# Altium project Vapeix_mini.PrjPcb
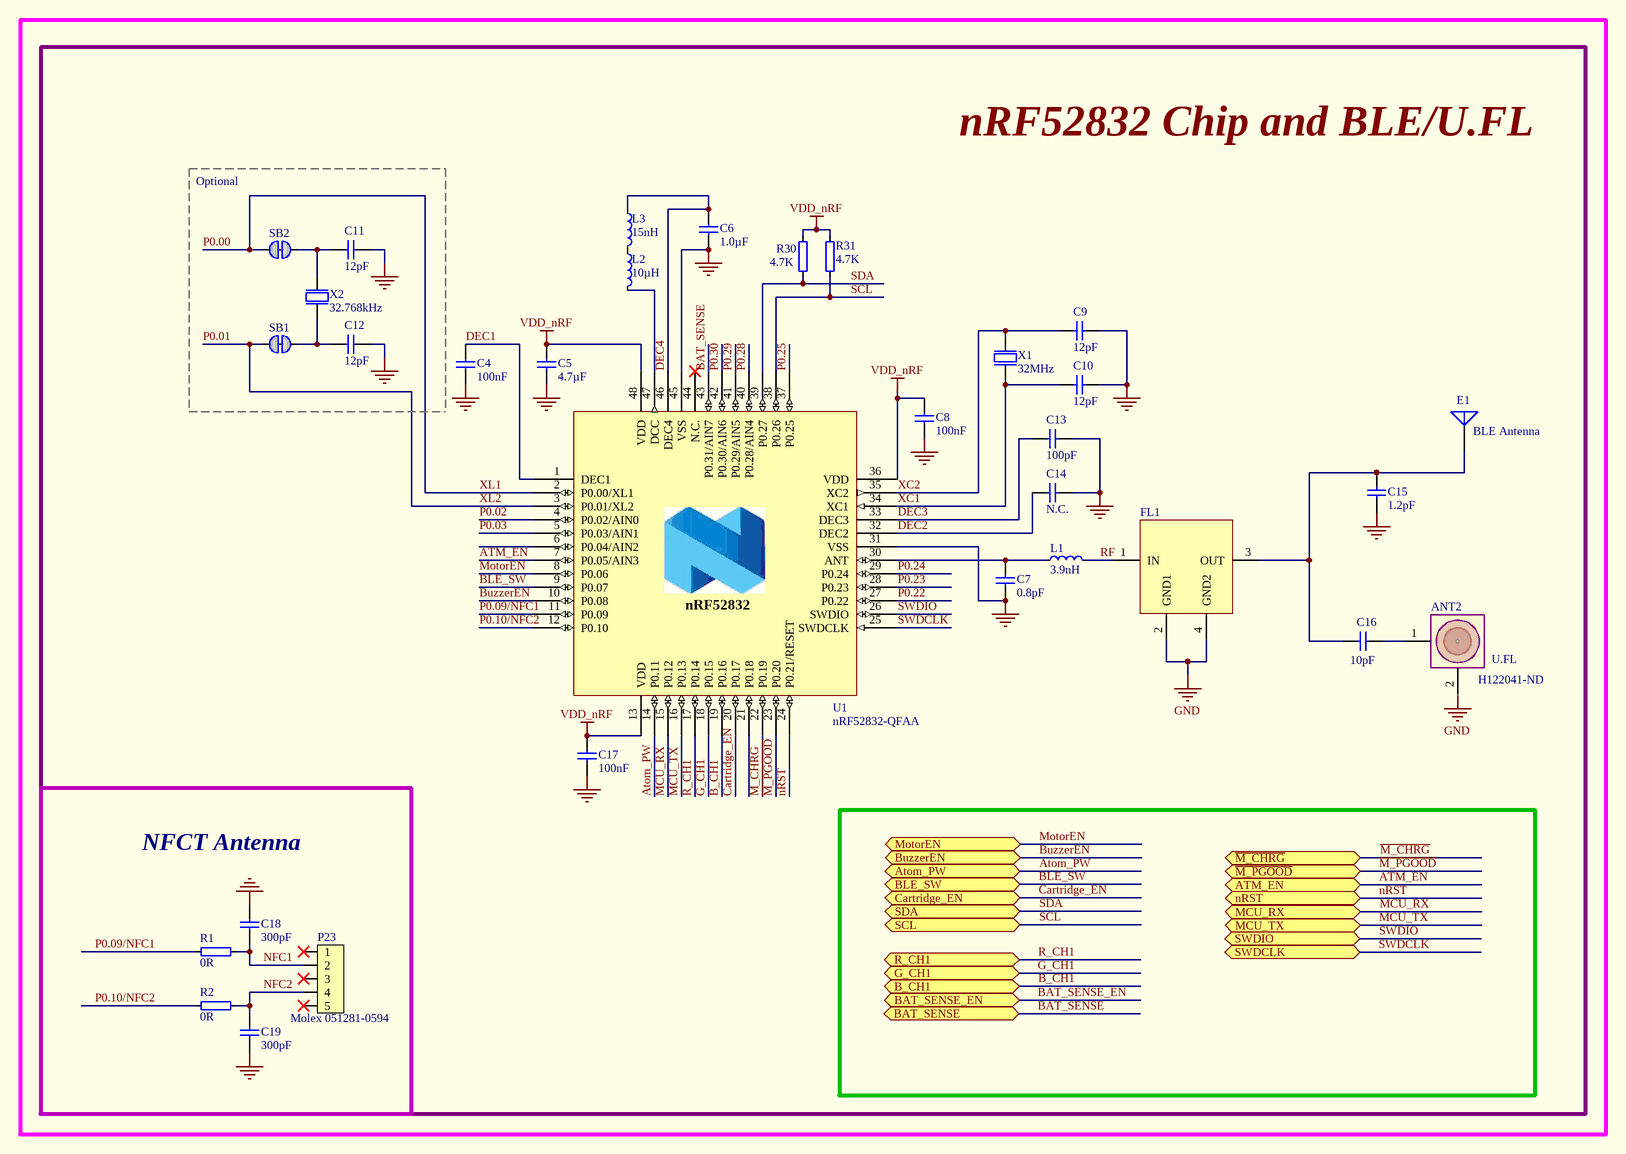
[diagram p0: Vapeix_mini_nrf.SchDoc]
4 sheets, 112 parts. Net scope: flat (ports and power ports of the same name join across sheets).
Sheets:
  Vapeix_mini_nrf.SchDoc
  Vapeix_mini_power.SchDoc
  Vapeix_mini_Shield.SchDoc
  Vapeix_mini_connector.SchDoc

## Sheet Vapeix_mini_nrf.SchDoc: Vapeix Mini PCB - nRF Radio
size A3; DrawnBy: Anne Moller; Organization: Altium Limited; Address1: L3, 12a Rodborough Rd; Address2: Frenchs Forest; Address3: NSW; Address4: Australia 2086; DocumentNumber: 1; Revision: v0.1; SheetNumber: 1; SheetTotal: 1

### Parts
(Parts that share a designator on the sheet are numbered #1, #2 ... from top to bottom, then left to right.)
ANT2  U.FL  Supplier Part Number 1: H122041-ND  [UFL-R-SMT]
C4  100nF  [CAPC1005X04L]
C5  4.7µF  [CAPC1608X06L]
C6  1.0µF  [CAPC1608X06L]
C7  0.8pF  [CAPC1005X04L]
C8  100nF  [CAPC1005X04L]
C9  12pF  [CAPC1005X04L]
C10  12pF  [CAPC1005X04L]
C11  12pF  [CAPC1005X04L]
C12  12pF  [CAPC1005X04L]
C13  100pF  [CAPC1005X04L]
C14  N.C.  [CAPC1005X04L]
C15  1.2pF  [CAPC1005X04L]
C16  10pF  [CAPC1005X04L]
C17  100nF  [CAPC1005X04L]
C18  300pF  [CAPC1005X04L]
C19  300pF  [CAPC1005X04L]
E1  BLE Antenna  [ANT_2450AT18A100]
FL1  DEA202450BT-1294C1-H  [DEA202450BT-1294C1-H]  (value not drawn)
L1  3.9nH  [INDC1005X04L]
L2  10µH  [INDC1608X06L]
L3  15nH  [INDC1005X04L]
P23  Molex 051281-0594  [Molex 051281-0594]
R1  0R  [RESC1005X04L]
R2  0R  [RESC1005X04L]
R30  4.7K  [RESC1005X04L]
R31#1  4.7K  [RESC1005X04L]
SB1  Solderbridge  [Solderbridge_Shorted]  (value not drawn)  (net tie, no BOM)
SB2  Solderbridge  [Solderbridge_Shorted]  (value not drawn)  (net tie, no BOM)
U1  nRF52832-QFAA  [QFN40P600X600X90-48N]
X1  32MHz  [BT-XTAL_2016]
X2  32.768kHz  [XTAL_3215]

### Blocks framed on the sheet
Optional: C11 C12 SB1 SB2 X2
NFCT Antenna: C18 C19 P23 R1 R2

### Ports
ATM_EN (bidir), Atom_PW (bidir), B_CH1 (bidir), BAT_SENSE (bidir), BAT_SENSE_EN (bidir), BLE_SW (bidir), BuzzerEN (bidir), Cartridge_EN (bidir), G_CH1 (bidir), MCU_RX (bidir), MCU_TX (bidir), MotorEN (bidir), nRST (bidir), R_CH1 (bidir), SCL (bidir), SDA (bidir), SWDCLK, SWDIO (bidir), ~{M_CHRG} (bidir), ~{M_PGOOD} (bidir)

### Nets
GND: C4.2 C5.2 C6.1 C7.1 C8.2 C9.2 C10.2 C11.1 C12.1 C13.2 C14.2 C15.2 C17.2 C18.2 C19.1 FL1.2(GND1) FL1.4(GND2) U1.31(VSS) U1.45(VSS) U1.49(GND) X1.2(GND) X1.4(GND)
VDD_nRF: C5.1 C8.1 C17.1 R30.2 R31#1.2 U1.13(VDD) U1.36(VDD) U1.48(VDD)
ATM_EN: U1.7(P0.05/AIN3) ; port ATM_EN
Atom_PW: U1.14(P0.11) ; port Atom_PW
B_CH1: U1.19(P0.16) ; port B_CH1
BAT_SENSE: U1.43(P0.31/AIN7) ; port BAT_SENSE
BLE_SW: U1.9(P0.07) ; port BLE_SW
BuzzerEN: U1.10(P0.08) ; port BuzzerEN
Cartridge_EN: U1.20(P0.17) ; port Cartridge_EN
DEC1: C4.1 U1.1(DEC1)
DEC2: C14.1 U1.32(DEC2)
DEC3: C13.1 U1.33(DEC3)
DEC4: C6.2 L3.1 U1.46(DEC4)
G_CH1: U1.18(P0.15) ; port G_CH1
~{M_PGOOD}: U1.23(P0.20) ; port ~{M_PGOOD}
M_CHRG: U1.22(P0.19)
MCU_RX: U1.15(P0.12) ; port MCU_RX
MCU_TX: U1.16(P0.13) ; port MCU_TX
MotorEN: U1.8(P0.06) ; port MotorEN
NFC1: C18.1 P23.2 R1.1
NFC2: C19.2 P23.4 R2.1
nRST: U1.24(P0.21/RESET) ; port nRST
P0.00: SB2.2 U1.2(P0.00/XL1)  [also labelled XL1]
P0.01: SB1.2 U1.3(P0.01/XL2)  [also labelled XL2]
P0.02: U1.4(P0.02/AIN0)
P0.03: U1.5(P0.03/AIN1)
P0.09/NFC1: R1.2 U1.11(P0.09)
P0.10/NFC2: R2.2 U1.12(P0.10)
P0.22: U1.27(P0.22)
P0.23: U1.28(P0.23)
P0.24: U1.29(P0.24)
P0.25: U1.37(P0.25)
P0.28: U1.40(P0.28/AIN4)
P0.29: U1.41(P0.29/AIN5)
P0.30: U1.42(P0.30/AIN6)
R_CH1: U1.17(P0.14) ; port R_CH1
RF: FL1.1(IN) L1.2
SCL: R31#1.1 U1.38(P0.26) ; port SCL
SDA: R30.1 U1.39(P0.27) ; port SDA
SWDCLK: U1.25(SWDCLK) ; port SWDCLK
SWDIO: U1.26(SWDIO) ; port SWDIO
XC1: C10.1 U1.34(XC1) X1.1(inp)
XC2: C9.1 U1.35(XC2) X1.3(out)
NetANT2_1: ANT2.1(SIG) C16.2
NetC7_2: C7.2 L1.1 U1.30(ANT)
NetC11_2: C11.2 SB2.1 X2.1(inp)
NetC12_2: C12.2 SB1.1 X2.2(out)
NetC15_1: C15.1 C16.1 E1.1(A) FL1.3(OUT)
NetL2_1: L2.1 L3.2
NetL2_2: L2.2 U1.47(DCC)

Not connected (* = marked no-connect by the designer): ANT2 2(GND); P23 1* 3* 5*; U1 6(P0.04/AIN2) 21(P0.18) 44(N.C.)*

### Notes on the sheet
- Labels drawn without touching a wire or pin: GND, nRF52832 Chip and BLE/U.FL
- Title
- Size:
- Date:
- A3
- Number:
- Time:
- Revision:
- Sheet
- of
- Drawn by:
- File:
- (in symbol nRF52832-QFAA) nRF52832

### Library data of the parts
ANT2 = U.FL-R-SMT-1(01): CONN UMC JACK STR 50 OHM SMD; Manufacturer: Hirose Electric Co Ltd; Connector Style: U.FL, Ultra Miniature Coaxial; Connector Type: Jack, Male Pin; Contact Termination: Solder; Impedance: 50 Ohm; Frequency - Max: 6GHz; Body Material: Phosphor Bronze; Body Finish: Silver; Center Contact Plating: Gold; Dielectric Material: Liquid Crystal Polymer (LCP); Supplier 1: Digi-Key; Manufacturer Part Number: U.FL-R-SMT-1(01); RoHS: RoHS Compliant; Category: Connectors, Interconnects; Stock 1: 2248; Pricing 1: 1=1.28, 10=1.122, 25=1.056, 50=1.012, 100=0.968, 250=0.88, 500=0.792, 1000=0.704, 2500=0.638 (USD); Packaging: Bulk; Shield Termination: Solder; Mounting Type: Surface Mount; Cable Group: -; Fastening Type: Snap-On; Features: -; Housing Color: Silver; Ingress Protection: -; Center Contact Material: Phosphor Bronze; Voltage Rating: -; Operating Temperature: -40°C ~ 90°C; ComponentLink1URL: http://media.digikey.com/pdf/Data%20Sheets/Hirose%20PDFs/UFL%20Series.pdf; ComponentLink1Description: http://media.digikey.com/pdf/Data%20Sheets/Hirose%20PDFs/UFL%20Series.pdf
C4 C8 C17 = C0402-100n: Capacitor, X7R, ±10%; Note: 16V; Artikkelnr Noca: 20039200; Artikkelnr Simpro: N.A.; Part Number: C0402-100n; Manufacturer: *; Manufacturer Part Number: *; Datasheet: *; LatestRevisionDate: 2009-11-23; Pin Count: 2; Publisher: Nordic Semiconductor; Published: 2009-05-08; Value: 100nF; Supplier: *; Supplier part number: *; 2nd source Supplier: *; 2nd source part number: *; Footprint Doc: 0402
C5 = C0603-4µ7: Capacitor, X5R, ±10%; Note: 6.3V; Artikkelnr Noca: 20069060; Artikkelnr Simpro: N.A.; Part Number: C0603-4µ7; Manufacturer: *; Manufacturer Part Number: *; Datasheet: *; LatestRevisionDate: 2009-11-23; Pin Count: 2; Publisher: Nordic Semiconductor; Published: 2009-05-08; Value: 4.7µF; Supplier: *; Supplier part number: *; 2nd source Supplier: *; 2nd source part number: *; Footprint Doc: 0603
C6 = C0603-1µ0: Capacitor, X7R, ±10%; Note: 16V; Artikkelnr Noca: 20039335; Artikkelnr Simpro: N.A.; Part Number: C0603-1µ0; Manufacturer: *; Manufacturer Part Number: *; Datasheet: *; LatestRevisionDate: 2013-06-05; Pin Count: 2; Publisher: Nordic Semiconductor; Published: 2009-05-08; Value: 1.0µF; Supplier: *; Supplier part number: *; 2nd source Supplier: *; 2nd source part number: *; Footprint Doc: 0603
C7 = C0402-0.8p: Capacitor, NP0, ±5%; Note: 50V; Artikkelnr Noca: 20029147; Artikkelnr Simpro: N.A.; Part Number: C0402-0.8p; Manufacturer: *; Manufacturer Part Number: *; Datasheet: *; LatestRevisionDate: 2012-11-21; Pin Count: 2; Publisher: Nordic Semiconductor; Published: 2009-05-08; Value: 0.8pF; Supplier: *; Supplier part number: *; 2nd source Supplier: *; 2nd source part number: *; Footprint Doc: 0402
C9-C12 = C0402-12p: Capacitor, NP0, ±2%; Note: 50V; Artikkelnr Noca: 20029159; Artikkelnr Simpro: N.A.; Part Number: C0402-12p; Manufacturer: *; Manufacturer Part Number: *; Datasheet: *; LatestRevisionDate: 2011-05-11; Pin Count: 2; Publisher: Nordic Semiconductor; Published: 2009-05-08; Value: 12pF; Supplier: *; Supplier part number: *; 2nd source Supplier: *; 2nd source part number: *; Footprint Doc: 0402
C13 = C0402-100p: Capacitor, NP0, ±5%; Note: 50V; Artikkelnr Noca: 20029135; Artikkelnr Simpro: N.A.; Part Number: C0402-100p; Manufacturer: *; Manufacturer Part Number: *; Datasheet: *; LatestRevisionDate: 2009-05-08; Pin Count: 2; Publisher: Nordic Semiconductor; Published: 2009-05-08; Value: 100pF; Supplier: *; Supplier part number: *; 2nd source Supplier: *; 2nd source part number: *; Footprint Doc: 0402
C14 C16 = C0402-N.C.: Not mounted; Note: Chip Cap; Artikkelnr Noca: N.A.; Part Number: C0402-N.C.; Manufacturer: *; Manufacturer Part Number: *; Datasheet: *; Footprint Doc: 0402; LatestRevisionDate: 2009-05-08; Pin Count: 2; Publisher: Nordic Semiconductor; Published: 2009-05-08; Supplier: *; Supplier part number: *; 2nd source Supplier: *; 2nd source part number: *; Artikkelnr Simpro: N.A.
  C14: Value: N.C.
  C16: Value: 10pF
C15 = C0402-1.2p: Capacitor, NP0, ±0.1pF; Note: 50V; Artikkelnr Noca: 20029157; Artikkelnr Simpro: N.A.; Part Number: C0402-1.2p; Manufacturer: *; Manufacturer Part Number: *; Datasheet: *; LatestRevisionDate: 2011-05-11; Pin Count: 2; Publisher: Nordic Semiconductor; Published: 2009-05-08; Value: 1.2pF; Supplier: *; Supplier part number: *; 2nd source Supplier: *; 2nd source part number: *; Footprint Doc: 0402
C18 C19 = C0402-300p: Capacitor, NP0, ±5%; Note: 50V; Artikkelnr Noca: N.A.; Part Number: C0402-300p; Manufacturer: *; Manufacturer Part Number: *; Datasheet: *; Footprint Doc: 0402; LatestRevisionDate: 2015-05-29; Pin Count: 2; Publisher: Nordic Semiconductor; Published: 2015-05-29; Value: 300pF; Supplier: Digi-Key; Supplier part number: 490-3234-1-ND; 2nd source Supplier: *; 2nd source part number: *; Artikkelnr Simpro: N.A.
E1 = Antenna: Generic Antenna; Published: 24-Mar-1999; LatestRevisionDate: 17-Jul-2002; LatestRevisionNote: Re-released for DXP Platform.; PackageReference: PIN1; Publisher: Altium Limited
FL1 = DEA202450BT-1294C1-H (2): FILTER BANDPASS WLAN&BLUETOOTH; Manufacturer: TDK Corporation; Supplier 1: Digi-Key; Manufacturer Part Number: DEA202450BT-1294C1-H; RoHS: RoHS Compliant; Category: Filters; Stock 1: 14479; Pricing 1: 1=0.51, 10=0.477, 100=0.4252, 250=0.40324, 500=0.33724, 1000=0.26173 (USD); ComponentLink1URL: https://product.tdk.com/info/en/documents/data_sheet/rf_bpf_dea202450bt-1294c1-h_en.pdf; ComponentLink1Description: https://product.tdk.com/info/en/documents/data_sheet/rf_bpf_dea202450bt-1294c1-h_en.pdf; Supplier Part Number 1: 445-172335-1-ND
L1 = L0402-3n9: Inductor, 170mA, ±0.1nH; Manufacturer: Murata; Manufacturer Part Number: LQP15MN3N9B02D; Note: High frequency chip inductor ±5%; Artikkelnr Noca: 33029151; Artikkelnr Simpro: N.A.; Part Number: L0402-3n9; Datasheet: http://search.murata.co.jp/Ceramy/image/img/PDF/ENG/L0075S0084LQP15M.pdf; LatestRevisionDate: 2012-09-19; Pin Count: 2; Publisher: Nordic Semiconductor; Published: 2009-05-08; Value: 3.9nH; Supplier: Digi-Key; Supplier part number: 490-1131-1-ND; 2nd source Supplier: *; 2nd source part number: *; Footprint Doc: 0402
L2 = L0603-10µ: Inductor, 80mA, ±10%; Manufacturer: Taiyo Yuden; Manufacturer Part Number: LBMF1608T100K; 2nd source part number: 178-6105; Note: LBMF1608T100K 10µH 80mA 0603; Artikkelnr Noca: 33029314; Artikkelnr Simpro: N.A.; Part Number: L0603-10µ; Datasheet: http://www.yuden.co.jp/ut/product/pdf/elb2_e.pdf; LatestRevisionDate: 2012-09-19; Pin Count: 2; Publisher: Nordic Semiconductor; Published: 2010-02-24; Value: 10µH; Supplier: Digi-Key; Supplier part number: 587-1714-1-ND; 2nd source Supplier: Farnell; Footprint Doc: 0603
L3 = L0402-15n: Inductor, 320mA, ±5%; Manufacturer: Taiyo Yuden; Manufacturer Part Number: HK100515NJ-T; 2nd source part number: 658-1328; Note: High frequency chip inductor ±10%; Artikkelnr Noca: 33029323; Artikkelnr Simpro: N.A.; Part Number: L0402-15n; LatestRevisionDate: 2012-09-19; Pin Count: 2; Publisher: Nordic Semiconductor; Published: 2010-07-12; Value: 15nH; Supplier: Digi-Key; Datasheet: http://www.yuden.co.jp/productdata/catalog/en/mlci04_e.pdf; Supplier part number: 587-1521-1-ND; 2nd source Supplier: Farnell; Footprint Doc: 0402
P23 = Molex 051281-0594: CONN FFC FPC 5POS 0.50MM R/A; Artikkelnr Noca: N.A.; Part Number: Molex 051281-0594; Manufacturer: Molex; Manufacturer Part Number: 051281-0594; Datasheet: http://www.molex.com/pdm_docs/sd/512810694_sd.pdf; Footprint Doc: Molex 051281-0594; LatestRevisionDate: 2015-06-22; Pin Count: 7; Publisher: Nordic Semiconductor; Published: 2015-06-22; Value: Molex 051281-0594; Note: *; Supplier: Digi-Key; Supplier part number: WM9836CT-ND; 2nd source Supplier: *; 2nd source part number: *; Artikkelnr Simpro: N.A.
R1 R2 = R0402-0R: Resistor, ±5%, 0.063W; Note: Chip Res 5%; Artikkelnr Noca: 27049000; Artikkelnr Simpro: N.A.; Part Number: R0402-0R; Manufacturer: *; Manufacturer Part Number: *; Datasheet: *; Footprint Doc: 0402; LatestRevisionDate: 2009-11-23; Pin Count: 2; Publisher: Nordic Semiconductor; Published: 2009-05-08; Value: 0R; Supplier: Farnell; Supplier part number: 146-9661; 2nd source Supplier: *; 2nd source part number: *
R30 R31#1 = R0402-10k: Resistor, ±1%, 0.063W; Note: Chip Res 1%; Artikkelnr Noca: 27049097; Artikkelnr Simpro: N.A.; Part Number: R0402-10k; Manufacturer: *; Manufacturer Part Number: *; Datasheet: *; Footprint Doc: 0402; LatestRevisionDate: 2009-11-23; Pin Count: 2; Publisher: Nordic Semiconductor; Published: 2009-05-08; Value: 4.7K; Supplier: Farnell; Supplier part number: 173-8864; 2nd source Supplier: *; 2nd source part number: *
SB1 SB2 = Solderbridge Shorted: Shorted Solderbridge; Artikkelnr Noca: N.A.; Part Number: Solderbridge Shorted; Manufacturer: *; Manufacturer Part Number: *; Datasheet: *; LatestRevisionDate: 2012-08-07; Pin Count: 2; Publisher: Nordic Semiconductor; Published: 2012-08-07; Value: Solderbridge; Note: *; Supplier: *; Supplier part number: *; 2nd source Supplier: *; 2nd source part number: *; Footprint Doc: Solderbridge_Shorted; Artikkelnr Simpro: N.A.
U1 = nRF52832-QFAA: Multi-protocol Bluetooth Low Energy and 2.4GHz proprietary system-on-chip; Manufacturer: Nordic Semiconductor; Artikkelnr Noca: N.A.; Part Number: nRF52832-QFAA; Manufacturer Part Number: nRF52832-QFAA; Datasheet: *; LatestRevisionDate: 2014-11-26; Pin Count: 48; Publisher: Nordic Semiconductor; Published: 2014-11-26; Value: nRF52832-QFAA; Note: *; Supplier: Nordic Semiconductor; Supplier part number: *; 2nd source Supplier: *; 2nd source part number: *; Footprint Doc: QFN-48; Artikkelnr Simpro: N.A.
X1 = XTAL_SMD2016_32MHz_8pF_Epson: XTAL SMD 2016, 32MHz, Cl=8pF, Tol: ±10ppm, Stab: ±10ppm; Manufacturer: Epson Toyocom; Manufacturer Part Number: Q22FA12800025; Note: XTAL SMD 32.000MHz; Artikkelnr Noca: N.A.; Part Number: XTAL_SMD2016_32MHz_8pF_Epson; Datasheet: http://www.epsondevice.com/docs/qd/en/DownloadServlet?id=ID000449; LatestRevisionDate: 2014-11-27; Pin Count: 4; Publisher: Nordic Semiconductor; Published: 2012-03-09; Value: 32MHz; Supplier: Farnell; Supplier part number: 171-2806; 2nd source Supplier: *; 2nd source part number: *; Footprint Doc: XTAL_2016; Artikkelnr Simpro: N.A.
X2 = XTAL_FC-135 32.768k: EPSON TOYOCOM - FC-135 32.768KHZ ±20PPM,9.0PF - CRYSTAL, SM, WATCH; 2nd source part number: 127-8037; Note: XTAL SMD 32.768kHz, 3215; Artikkelnr Noca: 22019091; Artikkelnr Simpro: N.A.; Part Number: XTAL_FC-135 32.768k; Manufacturer: Epson Toyocom; Manufacturer Part Number: FC-135 32.768KHZ ±20PPM,9.0PF; Datasheet: http://www.farnell.com/datasheets/57480.pdf; LatestRevisionDate: 2014-03-27; Pin Count: 2; Publisher: Nordic Semiconductor; Published: 2010-10-18; Value: 32.768kHz; Supplier: Digi-Key; Supplier part number: FC-135 32.7680KA-AC-ND; 2nd source Supplier: Farnell; Footprint Doc: XTAL_3215

## Sheet Vapeix_mini_power.SchDoc: Vapeix Mini PCB - Power Supply
size A3; DrawnBy: Anne Moller; Organization: Altium Limited; Address1: L3, 12a Rodborough Rd; Address2: Frenchs Forest; Address3: NSW; Address4: Australia 2086
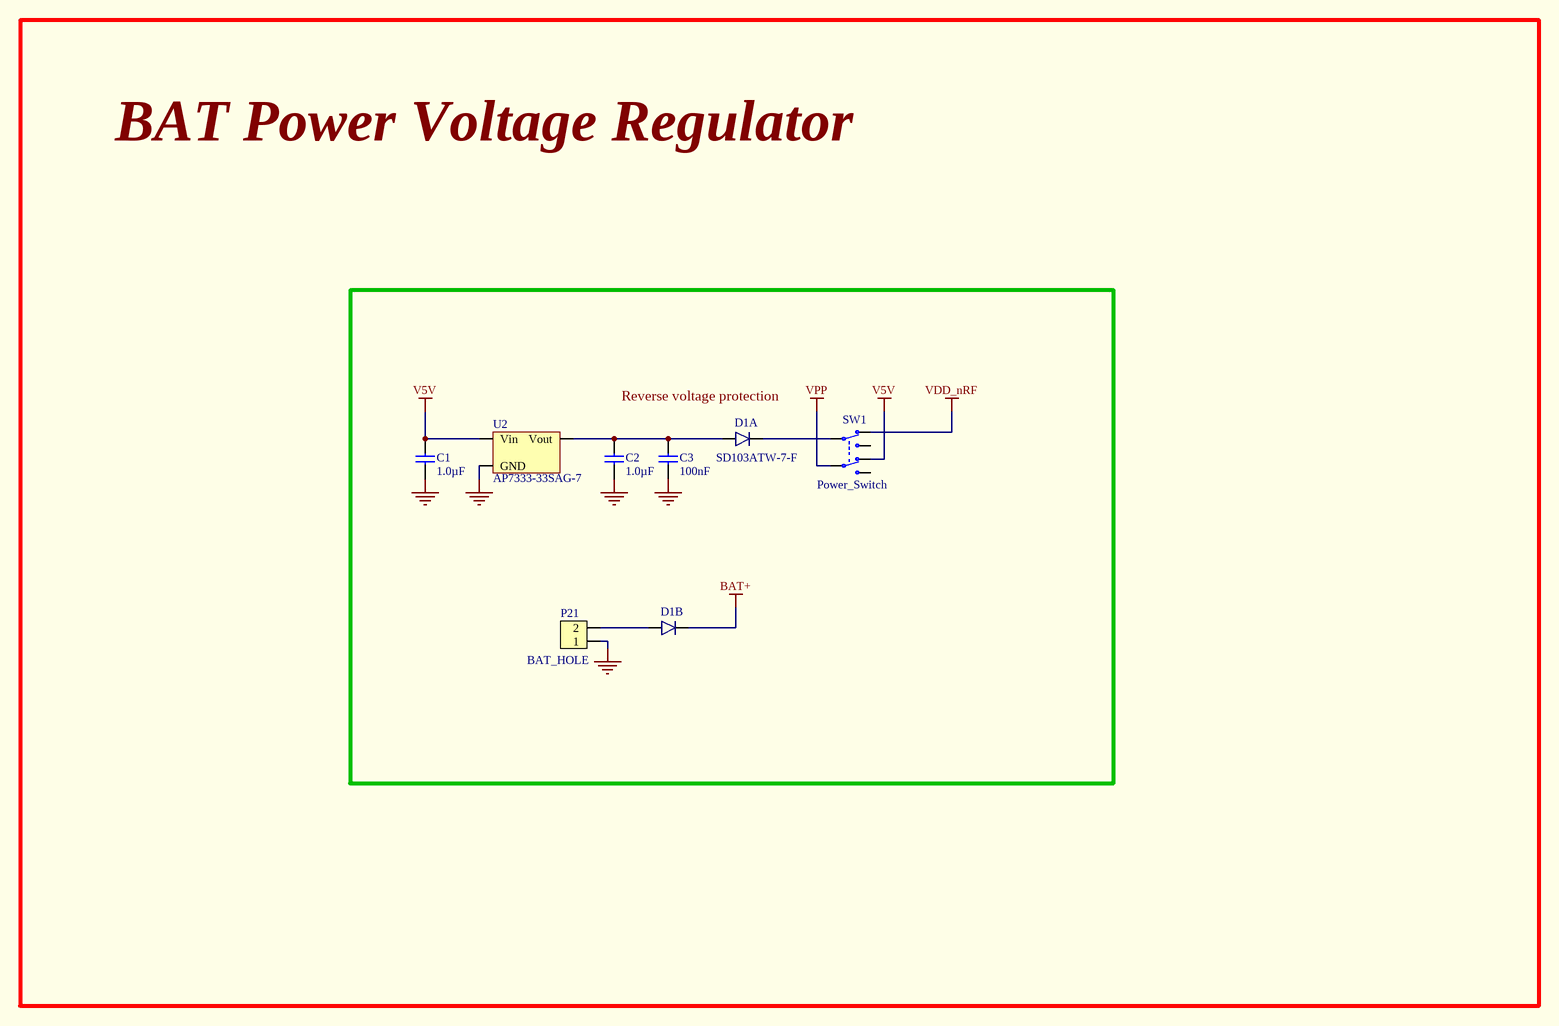
[diagram p1: Vapeix_mini_power.SchDoc]

### Parts
C1  1.0µF  [CAPC1608X06L]
C2  1.0µF  [CAPC1608X06L]
C3  100nF  [CAPC1005X04L]
D1  SD103ATW-7-F  [SOT-363]  (parts A,B of 3)
P21  BAT_HOLE  [LIST_ANG_1x2-SMD-2.54MM]
SW1  Power_Switch  [JS202011SCQN]
U2  AP7333-33SAG-7  [SOT-23A]

### Blocks framed on the sheet
Reverse voltage protection: C1-C3 D1 P21 SW1 U2

### Nets
BAT+: D1.2(C2)
GND: C1.1 C2.1 C3.1 P21.1 U2.3(GND)
V5V: C1.2 SW1.6(N.C-2) U2.1(Vin)
VDD_nRF: SW1.3(N.C-1)
VPP: SW1.5(COM-2)
NetC2_2: C2.2 C3.2 D1.6(A1) U2.2(Vout)
NetD1_1: D1.1(C1) SW1.2(COM-1)
NetD1_5: D1.5(A2) P21.2

Not connected (* = marked no-connect by the designer): SW1 1(N.O-1) 4(N.O-2)

### Notes on the sheet
- Labels drawn without touching a wire or pin: BAT Power Voltage Regulator
- Title
- Size:
- Date:
- A3
- Number:
- Time:
- Revision:
- Sheet
- of
- Drawn by:
- File:

### Library data of the parts
C1 C2 = C0603-1µ0: as C6 on sheet Vapeix_mini_nrf; Published: 2009-05-08; LatestRevisionDate: 2013-06-05; Publisher: Nordic Semiconductor; Value: 1.0µF; Part Number: C0603-1µ0; Manufacturer: *; Manufacturer Part Number: *; Datasheet: *; Pin Count: 2; Supplier: *; Supplier part number: *; 2nd source Supplier: *; 2nd source part number: *; Footprint Doc: 0603
C3 = C0402-100n: as C4 on sheet Vapeix_mini_nrf; Published: 2009-05-08; LatestRevisionDate: 2009-11-23; Publisher: Nordic Semiconductor; Value: 100nF; Part Number: C0402-100n; Manufacturer: *; Manufacturer Part Number: *; Datasheet: *; Pin Count: 2; Supplier: *; Supplier part number: *; 2nd source Supplier: *; 2nd source part number: *; Footprint Doc: 0402
D1 = D:DIODE_3_IND: Surface Mount Schottky Barrier Diode Array; Manufacturer: Diodes Incorporated; 2nd source part number: 177-3507; Artikkelnr Noca: 10029109; Artikkelnr Simpro: N.A.; Part Number: SD103ATW-7-F; Manufacturer Part Number: SD103ATW-7-F; Datasheet: http://www.diodes.com/datasheets/ds30374.pdf; LatestRevisionDate: 2012-06-15; Publisher: Nordic Semiconductor; Published: 2012-06-15; Value: SD103ATW-7-F; Note: *; Supplier: Digi-Key; Supplier part number: SD103ATW-FDITR-ND; 2nd source Supplier: Farnell; Footprint Doc: SOT-363
P21 = Pin List Ang 1x2 SMD, 2.54mm: Pin List 1x2, 2.54mm (100mil), Right Angled, SMD; 2nd source part number: S1113E-02-ND; Artikkelnr Noca: N.A.; Part Number: Pin List Ang 1x2 SMD, 2.54mm; Manufacturer: *; Manufacturer Part Number: *; Datasheet: *; LatestRevisionDate: 2014-04-30; Pin Count: 2; Publisher: Nordic Semiconductor; Published: 2014-04-30; Value: BAT_HOLE; Note: *; Supplier: Samtec; Supplier part number: TSM-102-01-L-SH-A; 2nd source Supplier: Digi-Key; Footprint Doc: LIST_ANG_1x2-SMD-2.54MM; Artikkelnr Simpro: N.A.
SW1 = JS202011SCQN: SMD slide Switch (ON-ON); Manufacturer: C&K Components; 2nd source part number: 232-0019; Artikkelnr Noca: N.A.; Part Number: JS202011SCQN; Manufacturer Part Number: JS202011SCQN; Datasheet: http://www.ck-components.com/14398/js_14july11.pdf/; LatestRevisionDate: 2014-06-24; Pin Count: 6; Publisher: Nordic Semiconductor; Published: 2014-06-24; Value: Power_Switch; Note: *; Supplier: Digi-Key; Supplier part number: 401-2002-1-ND; 2nd source Supplier: Farnell; Footprint Doc: JS202011SCQN; Artikkelnr Simpro: N.A.
U2 = AP7333-33SAG-7: 300mA, Low Quiescent Current, Fast Transient Low Dropout Linear Regulator; Manufacturer: Diodes Incorporated; Artikkelnr Noca: 17039216; Artikkelnr Simpro: N.A.; Part Number: AP7333-33SAG-7; Manufacturer Part Number: AP7333-33SAG-7; Datasheet: http://www.diodes.com/datasheets/AP7333.pdf; LatestRevisionDate: 2012-06-15; Pin Count: 3; Publisher: Nordic Semiconductor; Published: 2012-06-15; Value: AP7333-33SAG-7; Note: *; Supplier: Digi-Key; Supplier part number: AP7333-33SAG-7DICT-ND; 2nd source Supplier: *; 2nd source part number: *; Footprint Doc: SOT-23-3

## Sheet Vapeix_mini_Shield.SchDoc: Vapeix Mini PCB - Interface
size A3; DrawnBy: Anne Moller; Organization: Altium Limited; Address1: L3, 12a Rodborough Rd; Address2: Frenchs Forest; Address3: NSW; Address4: Australia 2086
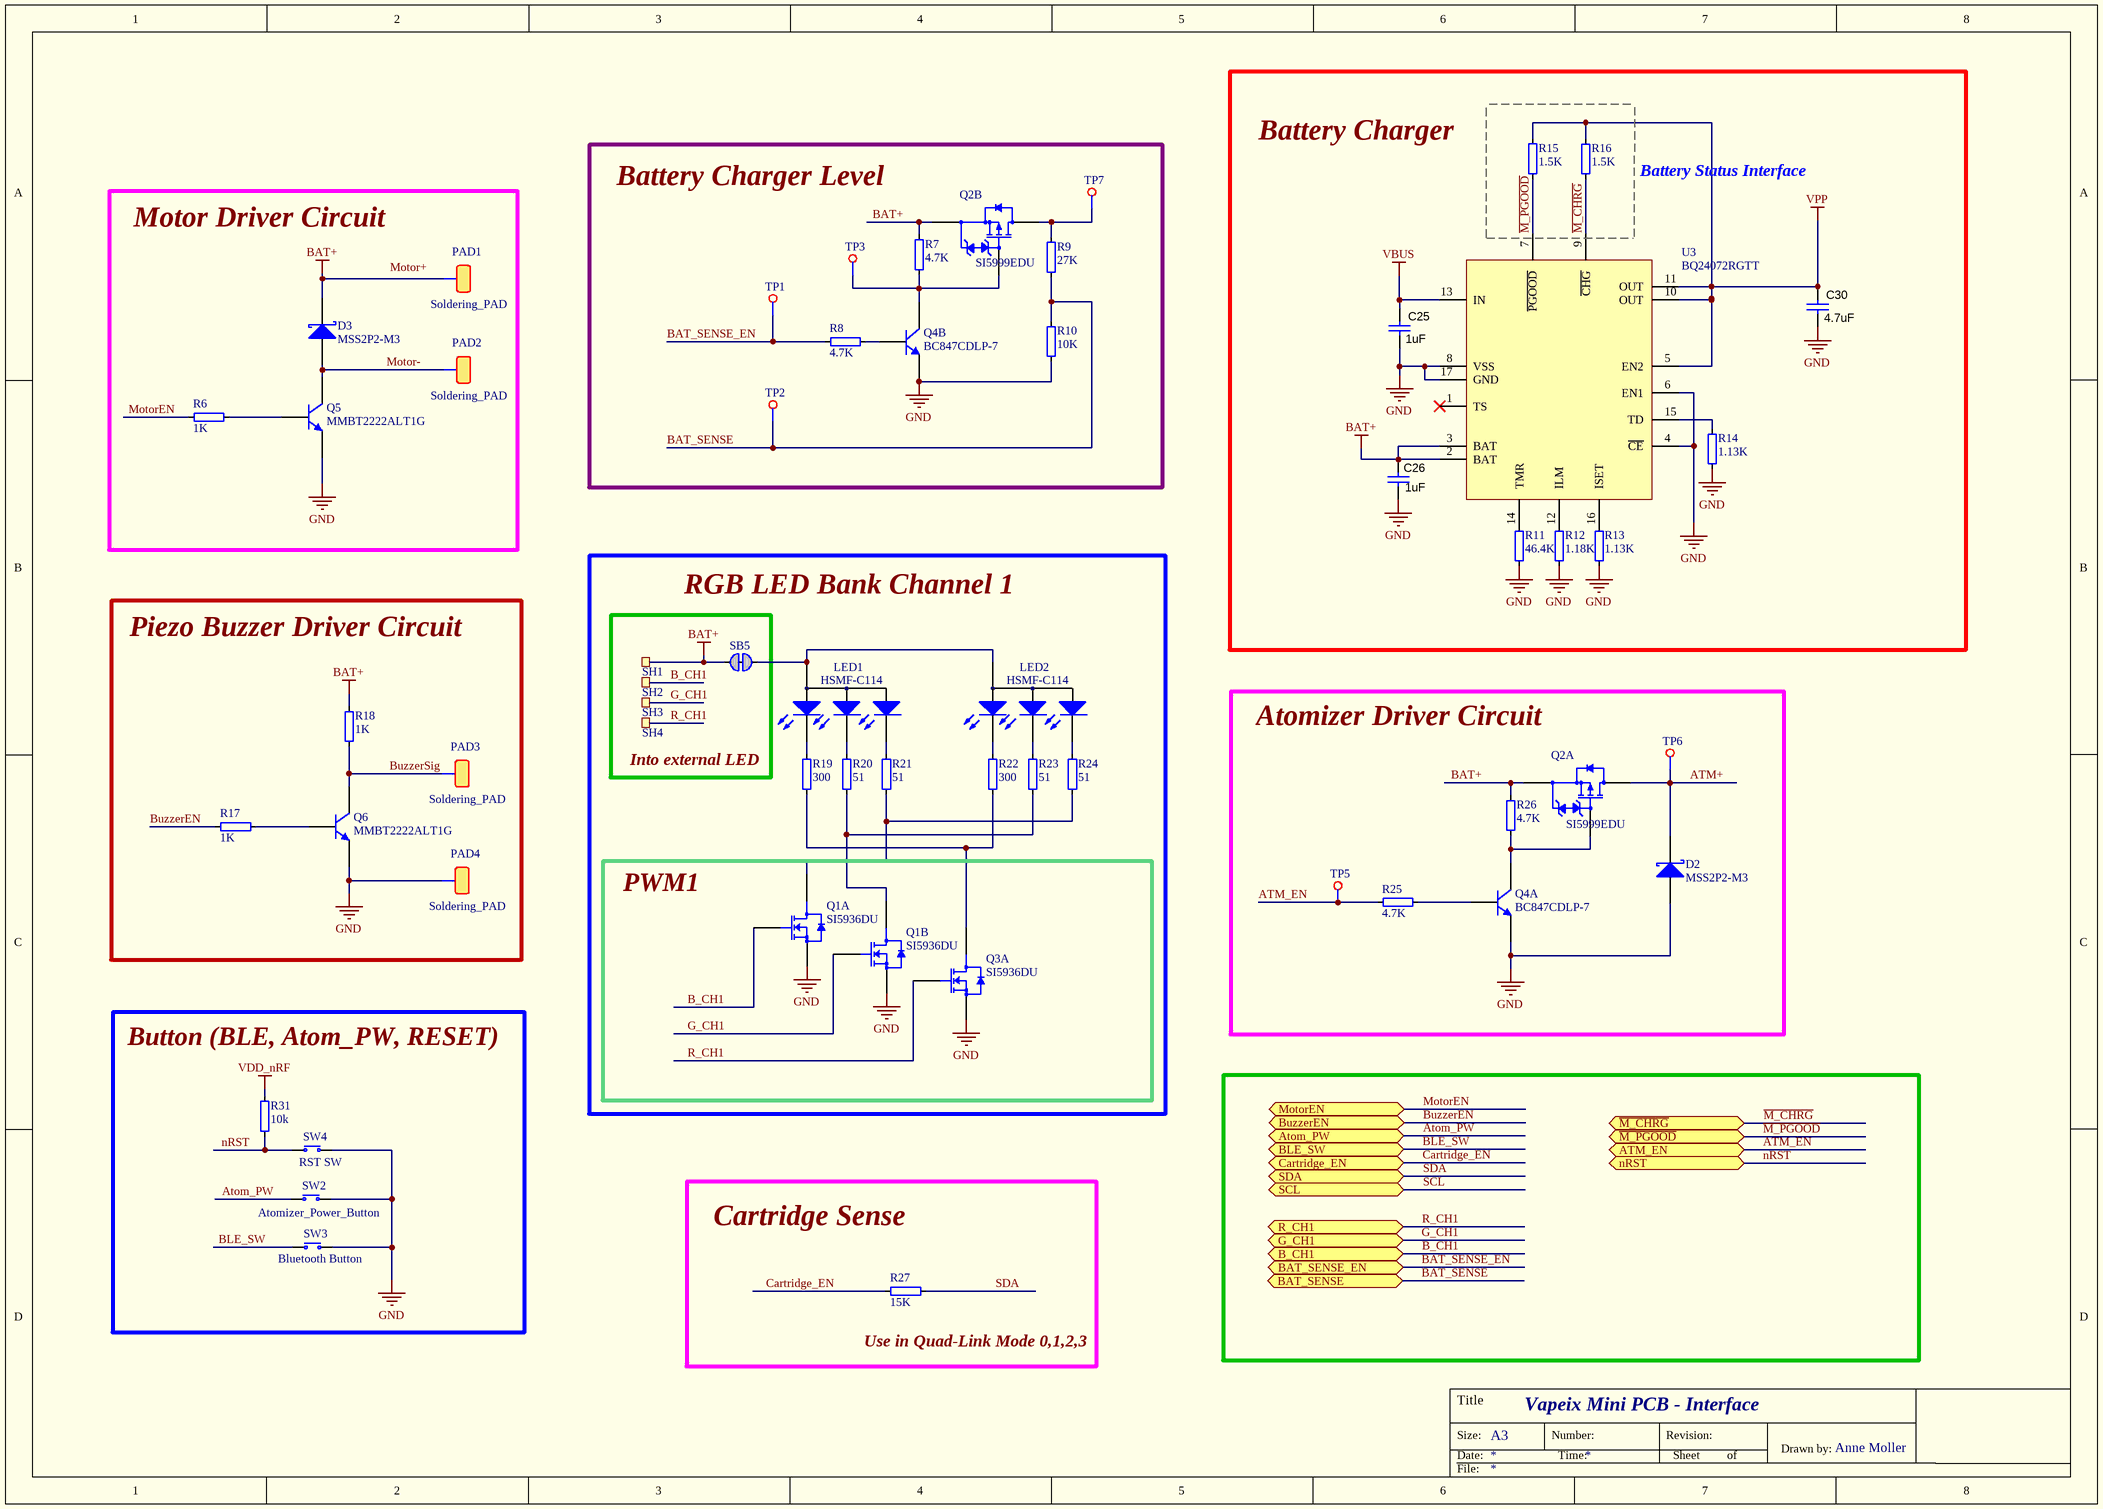
[diagram p2: Vapeix_mini_Shield.SchDoc]

### Parts
(Parts that share a designator on the sheet are numbered #1, #2 ... from top to bottom, then left to right.)
C25  ValueDisplayed: 1uF  [CAPC1608X06L]
C26  ValueDisplayed: 1uF  [CAPC1608X06L]
C30  ValueDisplayed: 4.7uF  [CAPC1608X06L]
D2  MSS2P2-M3  [MSS2P2-M3]
D3  MSS2P2-M3  [MSS2P2-M3]
LED1  HSMF-C114  [HSMF-C114]
LED2  HSMF-C114  [HSMF-C114]
PAD1  Soldering_PAD  [Soldering_PAD]
PAD2  Soldering_PAD  [Soldering_PAD]
PAD3  Soldering_PAD  [Soldering_PAD]
PAD4  Soldering_PAD  [Soldering_PAD]
Q1  SI5936DU  [SI5936DU]  (parts A,B of 2)
Q2  SI5999EDU  [SI5999EDU]  (parts A,B of 2)
Q3  SI5936DU  [SI5936DU]  (part A of 2)
Q4  BC847CDLP-7  [BC847CDLP-7]  (parts A,B of 2)
Q5  MMBT2222ALT1G  [MMBT2222ALT1G]
Q6  MMBT2222ALT1G  [MMBT2222ALT1G]
R6  1K  [RESC1005X04L]
R7  4.7K  [RESC1005X04L]
R8  4.7K  [RESC1005X04L]
R9  27K  [RESC1005X04L]
R10  10K  [RESC1005X04L]
R11  46.4K  [RESC1005X04L]
R12  1.18K  [RESC1005X04L]
R13  1.13K  [RESC1005X04L]
R14  1.13K  [RESC1005X04L]
R15  1.5K  [RESC1005X04L]
R16  1.5K  [RESC1005X04L]
R17  1K  [RESC1005X04L]
R18  1K  [RESC1005X04L]
R19  300  [RESC1005X04L]
R20  51  [RESC1005X04L]
R21  51  [RESC1005X04L]
R22  300  [RESC1005X04L]
R23  51  [RESC1005X04L]
R24  51  [RESC1005X04L]
R25  4.7K  [RESC1005X04L]
R26  4.7K  [RESC1005X04L]
R27  15K  [RESC1005X04L]
R31#2  10k  [RESC1005X04L]
SB5  Solderbridge  [Solderbridge_Shorted]  (value not drawn)  (net tie, no BOM)
SH1  TP  [TESTPAD-TH]  (value not drawn)  (no BOM)
SH2  TP  [TESTPAD-TH]  (value not drawn)  (no BOM)
SH3  TP  [TESTPAD-TH]  (value not drawn)  (no BOM)
SH4  TP  [TESTPAD-TH]  (value not drawn)  (no BOM)
SW2  Atomizer_Power_Button  [ALPS_SKHUxxx010_WO_GND]
SW3  Bluetooth Button  [ALPS_SKHUxxx010_WO_GND]
SW4  RST SW  [ALPS_SKHUxxx010_WO_GND]
TP1#1  TP  [TP]  (value not drawn)
TP2#1  TP  [TP]  (value not drawn)
TP3#1  TP  [TP]  (value not drawn)
TP5  TP  [TP]  (value not drawn)
TP6  TP  [TP]  (value not drawn)
TP7  TP  [TP]  (value not drawn)
U3  BQ24072RGTT  [BQ24072RGTT]

### Ports
ATM_EN (bidir), Atom_PW (bidir), B_CH1 (bidir), BAT_SENSE, BAT_SENSE_EN (bidir), BLE_SW (bidir), BuzzerEN (bidir), Cartridge_EN (bidir), G_CH1 (bidir), MotorEN (bidir), nRST (bidir), R_CH1 (bidir), SCL (bidir), SDA (bidir), ~{M_CHRG} (bidir), ~{M_PGOOD} (bidir)

### Nets
BAT+: C26.1 D3.2(K) PAD1.1(TP) Q2.1(S1) Q2.3(S2) R7.1 R18.1 R26.2 SB5.2 SH1.1 U3.2(BAT) U3.3(BAT)
GND: C25.2 C26.2 C30.2 D2.1(A) PAD4.1(TP) Q1.1(S1) Q1.3(S2) Q3.1(S1) Q4.1(E1) Q4.4(E2) Q5.2(E) Q6.2(E) R10.2 R11.2 R12.2 R13.2 R14.2 SW2.2(COM) SW3.2(COM) SW4.2(COM) U3.4(~{CE}) U3.6(EN1) U3.8(VSS) U3.17(GND)
VBUS: C25.1 U3.13(IN)
VDD_nRF: R31#2.2
VPP: C30.1 R15.1 R16.1 U3.5(EN2) U3.10(OUT) U3.11(OUT)
ATM+: D2.2(K) Q2.7(D1) TP6.1(TP)
ATM_EN: R25.1 TP5.1(TP) ; port ATM_EN
Atom_PW: SW2.1(N.O) ; port Atom_PW
B_CH1: Q1.2(G1) SH2.1 ; port B_CH1
BAT_SENSE: R9.2 R10.1 TP2#1.1(TP) ; port BAT_SENSE
BAT_SENSE_EN: R8.2 TP1#1.1(TP) ; port BAT_SENSE_EN
BLE_SW: SW3.1(N.O) ; port BLE_SW
BuzzerEN: R17.2 ; port BuzzerEN
BuzzerSig: PAD3.1(TP) Q6.3(C) R18.2
Cartridge_EN: R27.2 ; port Cartridge_EN
G_CH1: Q1.4(G2) SH3.1 ; port G_CH1
~{M_CHRG}: R16.2 U3.9(~{CHG}) ; port ~{M_CHRG}
~{M_PGOOD}: R15.2 U3.7(~{PGOOD}) ; port ~{M_PGOOD}
Motor-: D3.1(A) PAD2.1(TP) Q5.3(C)
MotorEN: R6.2 ; port MotorEN
nRST: R31#2.1 SW4.1(N.O) ; port nRST
R_CH1: Q3.2(G1) SH4.1 ; port R_CH1
SDA: R27.1 ; port SDA
NetLED1_1: LED1.1(ANODE) LED2.1(ANODE) SB5.1
NetLED1_2: LED1.2(RED) R19.1
NetLED1_3: LED1.3(GREEN) R20.1
NetLED1_4: LED1.4(BLUE) R21.1
NetLED2_2: LED2.2(RED) R22.1
NetLED2_3: LED2.3(GREEN) R23.1
NetLED2_4: LED2.4(BLUE) R24.1
NetQ1_5: Q1.5(D2) R20.2 R23.2
NetQ1_7: Q1.7(D1) R21.2 R24.2
NetQ2_2: Q2.2(G1) Q4.3(C1) R26.1
NetQ2_4: Q2.4(G2) Q4.6(C2) R7.2 TP3#1.1(TP)
NetQ2_5: Q2.5(D2) R9.1 TP7.1(TP)
NetQ3_7: Q3.7(D1) R19.2 R22.2
NetQ4_2: Q4.2(B1) R25.2
NetQ4_5: Q4.5(B2) R8.1
NetQ5_1: Q5.1(B) R6.1
NetQ6_1: Q6.1(B) R17.1
NetR11_1: R11.1 U3.14(TMR)
NetR12_1: R12.1 U3.12(ILM)
NetR13_1: R13.1 U3.16(ISET)
NetR14_1: R14.1 U3.15(TD)

Not connected (* = marked no-connect by the designer): U3 1(TS)*

### Notes on the sheet
- Labels drawn without touching a wire or pin: Atomizer Driver Circuit, Battery Charger, Battery Charger Level, Battery Status Interface, Button (BLE, Atom_PW, RESET), Cartridge Sense, Into external LED, Motor Driver Circuit, Motor+, Piezo Buzzer Driver Circuit, PWM1, RGB LED Bank Channel 1, Use in Quad-Link Mode 0,1,2,3
- Title
- Size:
- Date:
- A3
- Number:
- Time:
- Revision:
- Sheet
- of
- Drawn by:
- File:

### Library data of the parts
C25 C26 C30 = GRM219R61A106KE44D: CAP, CERM, 10 µF, 10 V, +/- 10%, X5R, 0805; Manufacturer: MuRata; Polarized: N; CompType: Capacitor; Value: 10uF; U/M: EA; Cap_F: 0.00001; Tolerance_%: 10; ESR_ohm: 0.005; Value1: 0.005 ohm; Value2: 10V; TaMin_C: -55; TaMax_C: 85; Cap_Case: 0805; SymbolVersion: 2008-07-09; PartNumber: GRM219R61A106KE44D; PackageReference: 0805; RoHS: Y; VDC_V: 10; MountType: SMT; Technology: Ceramic; TempCo: X5R; Published: 2008-06-19; Publisher: Texas Instruments; LatestRevisionDate: 2014-08-19; ComponentLink1Description: Datasheet link; ComponentLink1URL: http://psearch.murata.com/capacitor/product/GRM219R61A106KE44%23.pdf; Supplier 1: Digi-Key; Supplier Part Number 1: 490-4735-1-ND; Supplier 2: Mouser; Supplier Part Number 2: 81-GRM219R61A106KE4D; Supplier 3: Farnell; Supplier Part Number 3: 1845741
D2 D3 = MSS2P2-M3/89A: DIODE SCHOTTKY 20V 2A MICROSMP; Manufacturer: Vishay Semiconductor Diodes Division; Voltage - Forward (Vf) (Max) @ If: 600mV @ 2A; Speed: Fast Recovery =< 500ns, > 200mA (Io); Current - Reverse Leakage @ Vr: 250µA @ 20V; Capacitance @ Vr, F: 65pF @ 4V, 1MHz; Supplier 1: Digi-Key; Manufacturer Part Number: MSS2P2-M3/89A; RoHS: RoHS Compliant; Category: Discrete Semiconductor Products; Stock 1: 3961; Pricing 1: 1=0.37, 10=0.274, 100=0.1552, 500=0.1029, 1000=0.07892 (USD); Packaging: Digi-Reel®; Diode Type: Schottky; Voltage - DC Reverse (Vr) (Max): 20V; Current - Average Rectified (Io): 2A; Reverse Recovery Time (trr): -; Mounting Type: Surface Mount; Package / Case: MicroSMP; Supplier Device Package: MicroSMP; Operating Temperature - Junction: -55°C ~ 150°C; ComponentLink1URL: http://www.vishay.com/docs/89054/mss2p3.pdf; ComponentLink1Description: http://www.vishay.com/docs/89054/mss2p3.pdf
LED1 LED2 = HSMF-C114: LED RGB DIFFUSED 0606 SMD; Manufacturer: Broadcom Limited; Color: Red, Green, Blue (RGB); Lens Color: White; Millicandela Rating: 85mcd Red, 180mcd Green, 70mcd Blue; Lens Style/Size: Rectangle with Flat Top, 1.10mm x 1.50mm; Voltage - Forward (Vf) (Typ): 1.9V Red, 3.4V Green, 3.4V Blue; Current - Test: 20mA Red, 20mA Green, 20mA Blue; Viewing Angle: 140° Red, 145° Green, 145° Blue; Wavelength - Dominant: 626nm Red, 525nm Green, 470nm Blue; Wavelength - Peak: 637nm Red, 523nm Green, 468nm Blue; Supplier 1: Digi-Key; Manufacturer Part Number: HSMF-C114; RoHS: RoHS Compliant; Category: Optoelectronics; Stock 1: 11787; Pricing 1: 1=2.03, 10=1.62, 25=1.2376, 100=1.125, 250=0.99, 500=0.8325, 1000=0.72 (USD); Packaging: Digi-Reel®; Lens Transparency: Diffused; Mounting Type: Surface Mount; Features: -; Package / Case: 0606 (1616 Metric); Supplier Device Package: Chip LED; Size / Dimension: 1.60mm L x 1.50mm W; Height (Max): 0.35mm; ComponentLink1URL: http://www.avagotech.com/docs/AV02-2451EN; ComponentLink1Description: http://www.avagotech.com/docs/AV02-2451EN
PAD1-PAD4 = Soldering_PAD: Soldering PAD
Q1 Q3 = SI5936DU-T1-GE3: MOSFET 2N-CH 30V 6A PWRPK CHPFET; Manufacturer: Vishay Siliconix; FET Type: 2 N-Channel (Dual); FET Feature: Logic Level Gate; Rds On (Max) @ Id, Vgs: 30 mOhm @ 5A, 10V; Vgs(th) (Max) @ Id: 2.2V @ 250µA; Gate Charge (Qg) @ Vgs: 11nC @ 10V; Input Capacitance (Ciss) @ Vds: 320pF @ 15V; Power - Max: 10.4W; Supplier 1: Digi-Key; Manufacturer Part Number: SI5936DU-T1-GE3; RoHS: RoHS Compliant; Category: Discrete Semiconductor Products; Stock 1: 0; Pricing 1: 1=0.66, 10=0.578, 100=0.442, 500=0.3502, 1000=0.2805 (USD); Packaging: Cut Tape (CT); Drain to Source Voltage (Vdss): 30V; Current - Continuous Drain (Id) @ 25°C: 6A; Operating Temperature: -55°C ~ 150°C (TJ); Mounting Type: Surface Mount; Package / Case: PowerPAK® ChipFET™ Dual; Supplier Device Package: PowerPAK® ChipFet Dual; ComponentLink1URL: http://www.vishay.com/docs/62804/si5936du.pdf; ComponentLink1Description: http://www.vishay.com/docs/62804/si5936du.pdf; Supplier Part Number 1: SI5936DU-T1-GE3CT-ND
Q2 = SI5999EDU-T1-GE3: MOSFET 2P-CH 20V 6A POWERPAK; Manufacturer: Vishay Siliconix; FET Type: 2 P-Channel (Dual); FET Feature: Logic Level Gate; Rds On (Max) @ Id, Vgs: 59 mOhm @ 3.5A, 4.5V; Vgs(th) (Max) @ Id: 1.5V @ 250µA; Gate Charge (Qg) @ Vgs: 20nC @ 10V; Input Capacitance (Ciss) @ Vds: 496pF @ 10V; Power - Max: 10.4W; Supplier 1: Digi-Key; Manufacturer Part Number: SI5999EDU-T1-GE3; RoHS: RoHS Compliant; Category: Discrete Semiconductor Products; Stock 1: 2994; Pricing 1: 1=0.58, 10=0.51, 100=0.39, 500=0.309, 1000=0.2475 (USD); Packaging: Cut Tape (CT); Drain to Source Voltage (Vdss): 20V; Current - Continuous Drain (Id) @ 25°C: 6A; Operating Temperature: -55°C ~ 150°C (TJ); Mounting Type: Surface Mount; Package / Case: PowerPAK® ChipFET™ Dual; Supplier Device Package: PowerPAK® ChipFet Dual; ComponentLink1URL: http://www.vishay.com/docs/67019/si5999ed.pdf; ComponentLink1Description: http://www.vishay.com/docs/67019/si5999ed.pdf
Q4 = BC847CDLP-7: TRANS 2NPN 45V 0.1A 6DFN; Manufacturer: Diodes Incorporated; Transistor Type: 2 NPN (Dual); Current - Collector (Ic) (Max): 100mA; Vce Saturation (Max) @ Ib, Ic: 600mV @ 5mA, 100mA; Current - Collector Cutoff (Max): 15nA; DC Current Gain (hFE) (Min) @ Ic, Vce: 420 @ 2mA, 5V; Power - Max: 350mW; Frequency - Transition: 100MHz; Supplier 1: Digi-Key; Manufacturer Part Number: BC847CDLP-7; RoHS: RoHS Compliant; Category: Discrete Semiconductor Products; Stock 1: 11845; Pricing 1: 1=0.36, 10=0.29, 100=0.198, 500=0.1482, 1000=0.111 (USD); Packaging: Cut Tape (CT); Voltage - Collector Emitter Breakdown (Max): 45V; Mounting Type: Surface Mount; Package / Case: 6-SMD, No Lead; Supplier Device Package: 6-DFN1310H4 (1.0x1.3); ComponentLink1URL: http://www.diodes.com/_files/datasheets/ds30817.pdf; ComponentLink1Description: http://www.diodes.com/_files/datasheets/ds30817.pdf
Q5 Q6 = MMBT2222ALT1G: TRANS NPN 40V 0.6A SOT23; Manufacturer: ON Semiconductor; Current - Collector (Ic) (Max): 600mA; Vce Saturation (Max) @ Ib, Ic: 1V @ 50mA, 500mA; Current - Collector Cutoff (Max): 10nA (ICBO); DC Current Gain (hFE) (Min) @ Ic, Vce: 100 @ 150mA, 10V; Power - Max: 300mW; Frequency - Transition: 300MHz; Supplier 1: Digi-Key; Manufacturer Part Number: MMBT2222ALT1G; RoHS: RoHS Compliant; Category: Discrete Semiconductor Products; Stock 1: 0; Pricing 1: 1=0.1, 10=0.095, 100=0.0516, 500=0.03172, 1000=0.02163 (USD); Packaging: Cut Tape (CT); Transistor Type: NPN; Voltage - Collector Emitter Breakdown (Max): 40V; Mounting Type: Surface Mount; Package / Case: TO-236-3, SC-59, SOT-23-3; Supplier Device Package: SOT-23; ComponentLink1URL: http://www.onsemi.com/pub_link/Collateral/MMBT2222LT1-D.PDF; ComponentLink1Description: http://www.onsemi.com/pub_link/Collateral/MMBT2222LT1-D.PDF
R6-R10 R17-R27 R31#2 = R0402-10k: as R30 on sheet Vapeix_mini_nrf; Part Number: R0402-10k; Manufacturer: *; Manufacturer Part Number: *; Datasheet: *; LatestRevisionDate: 2009-11-23; Pin Count: 2; Publisher: Nordic Semiconductor; Published: 2009-05-08; Supplier: Farnell; Supplier part number: 173-8864; 2nd source Supplier: *; 2nd source part number: *; Footprint Doc: 0402
  R6 R17 R18: Value: 1K
  R7 R8 R25 R26: Value: 4.7K
  R9: Value: 27K
  R10: Value: 10K
  R19 R22: Value: 300
  R20 R21 R23 R24: Value: 51
  R27: Value: 15K
  R31#2: Value: 10k
R11-R16 = R0402-10k: Resistor, ±1%, 0.063W; Value: 10K; Note: Chip Res 1%; Artikkelnr Noca: 27049097; Artikkelnr Simpro: N.A.; Part Number: R0402-10k; Manufacturer: *; Manufacturer Part Number: *; Datasheet: *; LatestRevisionDate: 2009-11-23; Pin Count: 2; Publisher: Nordic Semiconductor; Published: 2009-05-08; Supplier: Farnell; Supplier part number: 173-8864; 2nd source Supplier: *; 2nd source part number: *; Footprint Doc: 0402
SB5 = Solderbridge Shorted: as SB1 on sheet Vapeix_mini_nrf; Part Number: Solderbridge Shorted; Manufacturer: *; Manufacturer Part Number: *; Datasheet: *; LatestRevisionDate: 2012-08-07; Pin Count: 2; Publisher: Nordic Semiconductor; Published: 2012-08-07; Value: Solderbridge; Note: *; Supplier: *; Supplier part number: *; 2nd source Supplier: *; 2nd source part number: *; Footprint Doc: Solderbridge_Shorted; Artikkelnr Simpro: N.A.
SH1-SH4 = TESTPAD_TH: Testpoint, through hole; Part Number: Testpoint TH; Artikkelnr Noca: N.A.; Manufacturer: *; Manufacturer Part Number: *; Datasheet: *; Footprint Doc: TESTPAD-TH; LatestRevisionDate: 2009-12-12; Pin Count: 1; Publisher: Nordic Semiconductor; Published: 2009-12-12; Value: TP; Note: *; Supplier: *; Supplier part number: *; 2nd source Supplier: *; 2nd source part number: *; Artikkelnr Simpro: N.A.
SW2 SW3 = ALPS_SKHUALE010: ALPS - SKHUALE010 - Tactile Switch, SPNO, SMD, 6.5x6.2x2.5mm; 2nd source part number: 688-SKHUALE010; Value: RST SW; Artikkelnr Noca: 50019001; Artikkelnr Simpro: N.A.; Part Number: ALPS_SKHUALE010; Manufacturer: Alps; Manufacturer Part Number: SKHUALE010; Datasheet: https://www1.elfa.se/data1/wwwroot/webroot/Z_DATA/03579000.pdf; LatestRevisionDate: 2010-02-01; Pin Count: 4; Publisher: Nordic Semiconductor; Published: 2010-02-01; Note: *; Supplier: Elfa; Supplier part number: 35-790-00; 2nd source Supplier: Mouser; Footprint Doc: ALPS_SKHUxxx010_WO_GND
SW4 = ALPS_SKHUALE010: ALPS - SKHUALE010 - Tactile Switch, SPNO, SMD, 6.5x6.2x2.5mm; 2nd source part number: 688-SKHUALE010; Artikkelnr Noca: 50019001; Artikkelnr Simpro: N.A.; Part Number: ALPS_SKHUALE010; Manufacturer: Alps; Manufacturer Part Number: SKHUALE010; Datasheet: https://www1.elfa.se/data1/wwwroot/webroot/Z_DATA/03579000.pdf; LatestRevisionDate: 2010-02-01; Pin Count: 4; Publisher: Nordic Semiconductor; Published: 2010-02-01; Value: RST SW; Note: *; Supplier: Elfa; Supplier part number: 35-790-00; 2nd source Supplier: Mouser; Footprint Doc: ALPS_SKHUxxx010_WO_GND
TP1#1 TP2#1 TP3#1 TP5-TP7 = TP: TEST POINT
U3 = BQ24072RGTT: TEXAS INSTRUMENTS - BQ24072RGTT - BATTERY CHARGER LI-ION, 1.5A, QFN-16; Input Voltage: 26; Battery Charge Voltage: 4.2; Charge Current Max: 1.2; Battery IC Case Style: QFN; No. of Pins: 16; No. of Series Cells: 1; Supplier 1: Newark; Manufacturer: TEXAS INSTRUMENTS; Manufacturer Part Number: BQ24072RGTT; RoHS: YES; Stock 1: 134; Pricing 1: 1=1.6, 10=1.6, 25=1.47, 50=1.47, 100=1.47 (USD); Battery Type: Li-Ion; Operating Temperature Min: -40 C; ComponentLink1URL: http://www.farnell.com/cad/1638885.zip; ComponentLink1Description: http://www.farnell.com/cad/1638885.zip; ComponentLink2URL: http://www.farnell.com/datasheets/2001589.pdf; ComponentLink2Description: http://www.farnell.com/datasheets/2001589.pdf; Supplier Part Number 1: 12P6258

## Sheet Vapeix_mini_connector.SchDoc: Vapeix Mini PCB - Connectors
size A3; DrawnBy: Anne Moller; Organization: Altium Limited; Address1: L3, 12a Rodborough Rd; Address2: Frenchs Forest; Address3: NSW; Address4: Australia 2086
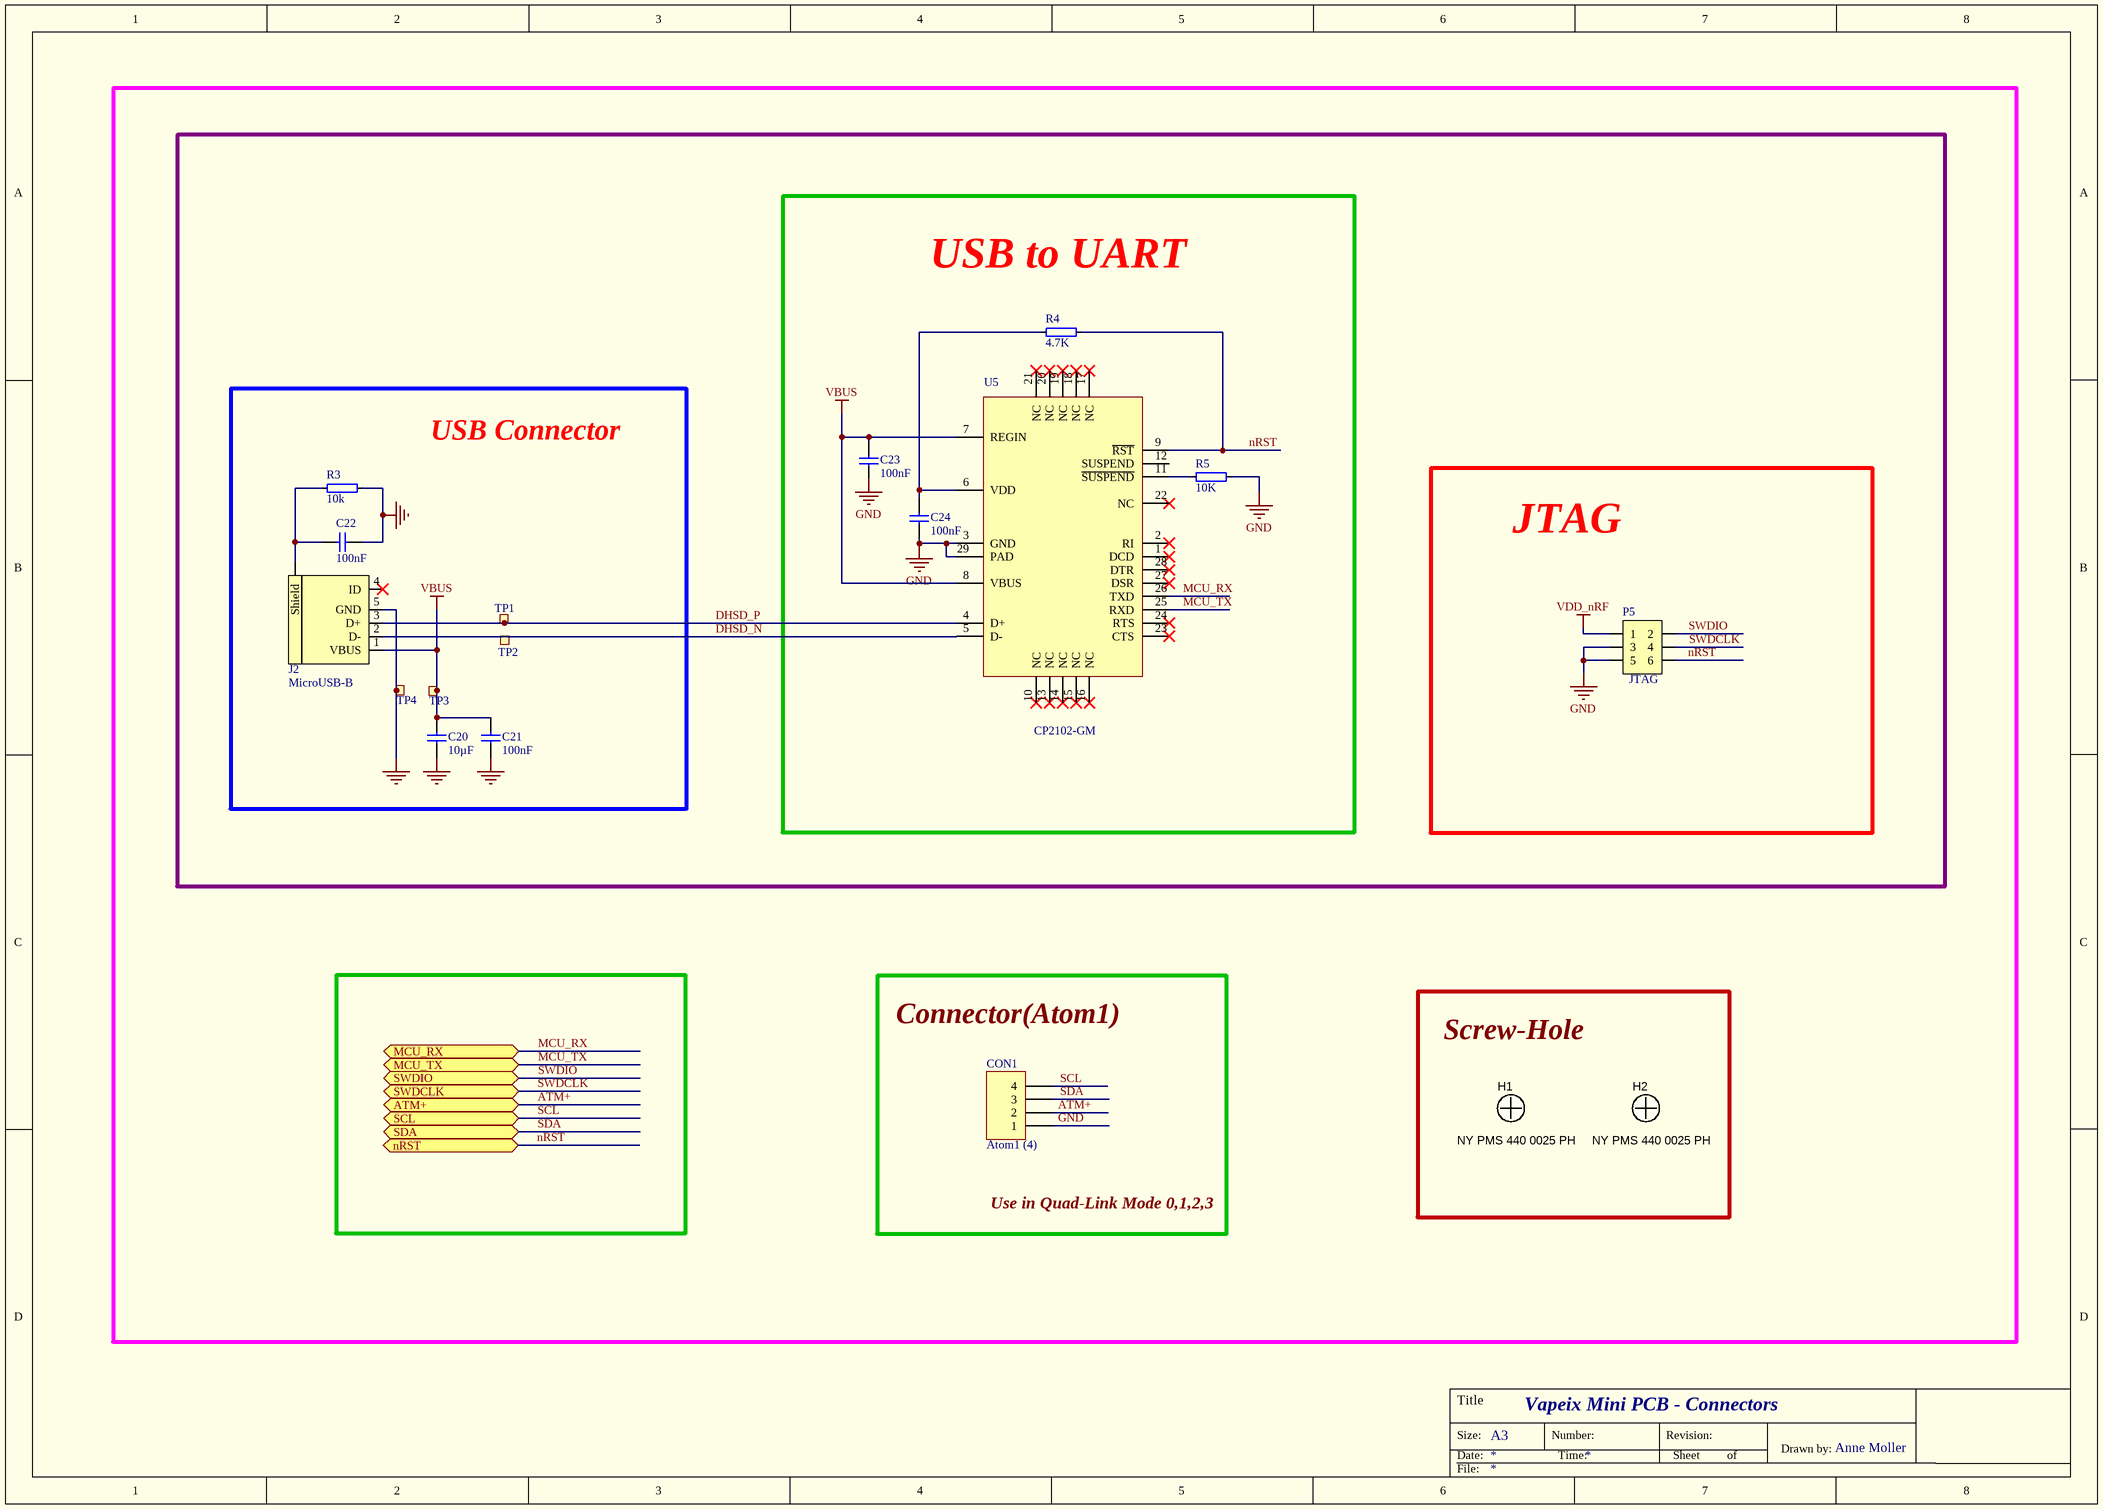
[diagram p3: Vapeix_mini_connector.SchDoc]

### Parts
(Parts that share a designator on the sheet are numbered #1, #2 ... from top to bottom, then left to right.)
C20  10µF  [CAPC1608X06L]
C21  100nF  [CAPC1005X04L]
C22  100nF  [CAPC1005X04L]
C23  100nF  [CAPC1005X04L]
C24  100nF  [CAPC1005X04L]
CON1  Atom1 (4)  [S4B-PH-K-S]
H1  NY PMS 440 0025 PH  [SCREW_HOLE2]
H2  NY PMS 440 0025 PH  [SCREW_HOLE2]
J2  MicroUSB-B  [FCI_10118193-0001LF]
P5  JTAG  [Molex 15-91-2060]
R3  10k  [RESC1005X04L]
R4  4.7K  [RESC1005X04L]
R5  10K  [RESC1005X04L]
TP1#2  Ø1.0mm,SMD  [TP_SMD_Ø1.0mm]  (value not drawn)  (no BOM)
TP2#2  Ø1.0mm,SMD  [TP_SMD_Ø1.0mm]  (value not drawn)  (no BOM)
TP3#2  Ø1.0mm,SMD  [TP_SMD_Ø1.0mm]  (value not drawn)  (no BOM)
TP4  Ø1.0mm,SMD  [TP_SMD_Ø1.0mm]  (value not drawn)  (no BOM)
U5  CP2102-GM  [CP2102-GM]

### Ports
ATM+ (bidir), MCU_RX (bidir), MCU_TX (bidir), nRST, SCL (bidir), SDA (bidir), SWDCLK, SWDIO (bidir)

### Nets
GND: C20.1 C21.1 C22.1 C24.1 CON1.1 J2.5(GND) P5.3 P5.5 R3.1 R5.2 TP4.1 U5.3(GND) U5.29(PAD)
VBUS: C20.2 C21.2 C23.2 J2.1(VBUS) TP3#2.1 U5.7(REGIN) U5.8(VBUS)
VDD_nRF: P5.1
ATM+: CON1.2 ; port ATM+
DHSD_N: J2.2(D-) TP2#2.1 U5.5(D-)
DHSD_P: J2.3(D+) TP1#2.1 U5.4(D+)
MCU_RX: U5.26(TXD) ; port MCU_RX
MCU_TX: U5.25(RXD) ; port MCU_TX
nRST: P5.6 R4.2 U5.9(~{RST}) ; port nRST
SCL: CON1.4 ; port SCL
SDA: CON1.3 ; port SDA
SWDCLK: P5.4 ; port SWDCLK
SWDIO: P5.2 ; port SWDIO
NetC22_2: C22.2 J2.6(Shield) R3.2
NetC24_2: C24.2 R4.1 U5.6(VDD)
NetR5_1: R5.1 U5.11(~{SUSPEND})

Not connected (* = marked no-connect by the designer): C23 1; J2 4(ID)*; U5 1(DCD)* 2(RI)* 10(NC)* 12(SUSPEND) 13(NC)* 14(NC)* 15(NC)* 16(NC)* 17(NC)* 18(NC)* 19(NC)* 20(NC)* 21(NC)* 22(NC)* 23(CTS)* 24(RTS)* 27(DSR)* 28(DTR)*

### Notes on the sheet
- Labels drawn without touching a wire or pin: Connector(Atom1), GND, JTAG, Screw-Hole, USB Connector, USB to UART, Use in Quad-Link Mode 0,1,2,3
- Title
- Size:
- Date:
- A3
- Number:
- Time:
- Revision:
- Sheet
- of
- Drawn by:
- File:

### Library data of the parts
C20 = C0603-10µ: Capacitor, X5R, ±20%; Note: 6.3V; Artikkelnr Noca: 20039234; Artikkelnr Simpro: N.A.; Part Number: C0603-10µ; Manufacturer: *; Manufacturer Part Number: *; Datasheet: *; LatestRevisionDate: 2011-01-17; Pin Count: 2; Publisher: Nordic Semiconductor; Published: 2011-01-17; Value: 10µF; Supplier: *; Supplier part number: *; 2nd source Supplier: *; 2nd source part number: *; Footprint Doc: 0603
C21-C24 = C0402-100n: as C4 on sheet Vapeix_mini_nrf; Part Number: C0402-100n; Manufacturer: *; Manufacturer Part Number: *; Datasheet: *; LatestRevisionDate: 2009-11-23; Pin Count: 2; Publisher: Nordic Semiconductor; Published: 2009-05-08; Value: 100nF; Supplier: *; Supplier part number: *; 2nd source Supplier: *; 2nd source part number: *; Footprint Doc: 0402
CON1 = S4B-PH-K-S(LF)(SN): CONN HEADER PH SIDE 4POS 2MM; Manufacturer: JST Sales America Inc.; Connector Type: Header, Shrouded; Number of Positions: 4; Number of Positions Loaded: All; Pitch: 0.079" (2.00mm); Supplier 1: Digi-Key; Manufacturer Part Number: S4B-PH-K-S(LF)(SN); RoHS: RoHS Compliant; Category: Connectors, Interconnects; Stock 1: 41576; Pricing 1: 1=0.22, 10=0.208, 25=0.1772, 50=0.155, 100=0.144, 250=0.1274, 500=0.12186, 1000=0.0997, 2500=0.09139 (USD); Packaging: Bulk; Contact Type: Male Pin; Number of Rows: 1; Row Spacing: -; Contact Mating Length: 0.130" (3.30mm); Mounting Type: Through Hole, Right Angle; Termination: Press-Fit, Solder; Fastening Type: Detent Lock; Features: -; Contact Finish: Tin; Contact Finish Thickness: -; Color: Natural; ComponentLink1URL: http://www.jst-mfg.com/product/pdf/eng/ePH.pdf; ComponentLink1Description: http://www.jst-mfg.com/product/pdf/eng/ePH.pdf
H1 H2 = Screw-Hole: Machine Screw, Round, #4-40 x 1/4, Nylon, Philips panhead; Manufacturer: B&F Fastener Supply; CompType: Hardware; SymbolCreator: codlsc; U/M: EA; SymbolVersion: 2009-10-28; MountType: N/A; RoHS: Y; PartNumber: NY PMS 440 0025 PH; PackageReference: Screw; DigiKeyPartNumber: H542-ND; ComponentLink1Description: Datasheet Link; ComponentLink1URL: http://www.fasnetdirect.com/refguide/Machinepancombo.pdf; ClassName: Mounting Holes; LatestRevisionDate: 2014-05-15; Publisher: Texas Instruments; Supplier 1: Digi-Key; Supplier Part Number 1: H542-ND
J2 = FCI 10118193-0001LF: MicroUSB-B-SMT; Manufacturer: FCI; 2nd source part number: 649-10118193-0001LF; Artikkelnr Noca: N.A.; Part Number: FCI 10118193-0001LF; Manufacturer Part Number: 10118193-0001LF; Datasheet: http://portal.fciconnect.com/Comergent//fci/drawing/10118193.pdf; Footprint Doc: FCI_10118193-0001LF; LatestRevisionDate: 2014-10-07; Pin Count: 5; Publisher: Nordic Semiconductor; Published: 2014-10-07; Value: MicroUSB-B; Note: *; Supplier: Digi-Key; Supplier part number: 609-4616-1-ND; 2nd source Supplier: Mouser; Artikkelnr Simpro: N.A.
P5 = 0015912060: CONN HEADER 6POS .100" VERT TIN; Manufacturer: Molex, LLC; Connector Type: Header, Unshrouded, Breakaway; Number of Positions: 6; Number of Positions Loaded: All; Pitch: 0.100" (2.54mm); Supplier 1: Digi-Key; Manufacturer Part Number: 0015912060; RoHS: RoHS Compliant; Category: Connectors, Interconnects; Stock 1: 10294; Pricing 1: 1=0.43, 10=0.4, 25=0.36, 50=0.32, 100=0.3066, 250=0.27992, 500=0.2666, 1000=0.21995, 2500=0.19995 (USD); Packaging: Bulk; Contact Type: Male Pin; Number of Rows: 2; Row Spacing: 0.100" (2.54mm); Contact Mating Length: 0.240" (6.10mm); Mounting Type: Surface Mount; Termination: Solder; Fastening Type: -; Features: -; Contact Finish: Tin; Contact Finish Thickness: 150µin (3.81µm); Color: Black; ComponentLink1URL: http://www.molex.com/pdm_docs/sd/015912060_sd.pdf; ComponentLink1Description: http://www.molex.com/pdm_docs/sd/015912060_sd.pdf
R3 R5 = R0402-10k: as R30 on sheet Vapeix_mini_nrf; Value: 10k; Part Number: R0402-10k; Manufacturer: *; Manufacturer Part Number: *; Datasheet: *; LatestRevisionDate: 2009-11-23; Pin Count: 2; Publisher: Nordic Semiconductor; Published: 2009-05-08; Supplier: Farnell; Supplier part number: 173-8864; 2nd source Supplier: *; 2nd source part number: *; Footprint Doc: 0402
R4 = R0402-10k: Resistor, ±1%, 0.063W; Value: 10k; Note: Chip Res 1%; Artikkelnr Noca: 27049097; Artikkelnr Simpro: N.A.; Part Number: R0402-10k; Manufacturer: *; Manufacturer Part Number: *; Datasheet: *; LatestRevisionDate: 2009-11-23; Pin Count: 2; Publisher: Nordic Semiconductor; Published: 2009-05-08; Supplier: Farnell; Supplier part number: 173-8864; 2nd source Supplier: *; 2nd source part number: *; Footprint Doc: 0402
TP1#2 TP2#2 TP3#2 TP4 = TP_SMD_Ø1.0MM: 1.0mm circular SMD testpad; Manufacturer: Nordic Semiconductor; Artikkelnr Noca: N.A.; Part Number: TP_SMD_Ø1.0MM; Manufacturer Part Number: *; Datasheet: *; LatestRevisionDate: 2013-06-11; Pin Count: 1; Publisher: Nordic Semiconductor; Published: 2013-06-11; Value: Ø1.0mm,SMD; Note: *; Supplier: *; Supplier part number: *; 2nd source Supplier: *; 2nd source part number: *; Footprint Doc: TP_SMD_Ø1.0mm; Artikkelnr Simpro: N.A.
U5 = CP2102-GM: SILICON LABS - CP2102-GM - USB-TO-UART BRIDGE, 3.6V, MLP-28; USB Type: USB UART; USB Standard: USB 2.0; Supply Voltage Min: 3; Supply Voltage Max: 3.6; Interface Case Style: QFN; No. of Pins: 28; Data Rate: 1; No. of Ports: 1 Port; Base Number: 2102; Bridge Type: USB to UART; Supply Voltage Range: 3V to 5.25V<!--FANDB--><div class="features-and-benefits-container"><div class="features-and-benefits-desc-container"><span class="features-and-benefits-container-desc">USB to UART Bridge Controller in QFN-28 Package</span></div><div class="features-and-benefits-description"><span class="features-benefits-value">The CP2102-GM is a highly integrated USB to UART Bridge Controller providing a simple solution for updating RS-232 designs to USB using a minimum of components and PCB space. The CP2102-GM includes a USB 2.0 full speed function controller, USB transceiver, oscillator, EEPROM, and asynchronous serial data bus (UART) with full modem control signals. No other external USB components are required. The on chip EEPROM may be used to customise the USB Vendor ID, Product ID, Product Description String, Power Descriptor, Device Release Number, and Device Serial Number as desired for OEM applications. The EEPROM is programmed on board via the USB, allowing the programming step to be easily integrated into the product manufacturing and testing process.</span></div><div class="features-and-benefits-list"><ul class="features-and-benefits-list-list"><li class="features-and-benefits-list-item">Integrated USB transceiver; no external crystal required</li><li class="features-and-benefits-list-item">Integrated 1024 Byte EEPROM</li><li class="features-and-benefits-list-item">On chip power on reset circuit</li><li class="features-and-benefits-list-item">On chip voltage regulator: 3.3V output</li><li class="features-and-benefits-list-item">USB Specification 2.0 compliant; full-speed (12 Mbps)</li><li class="features-and-benefits-list-item">USB suspend states supported via SUSPEND pins</li><li class="features-and-benefits-list-item">All handshaking and modem interface signals</li><li class="features-and-benefits-list-item">Baud rates: 300 bps to 1 Mbits</li><li class="features-and-benefits-list-item">576 Byte receive buffer; Supplier 1: Farnell; Manufacturer: SILICON LABS; Manufacturer Part Number: CP2102-GM; RoHS: YES; Stock 1: 9194; Pricing 1: 1=1.82, 10=1.72, 100=1.69, 250=1.66, 500=1.62, 2000=1.59, 3000=1.56, 5000=1.55 (GBP); Operating Temperature Min: -40; Operating Temperature Max: 85; Packaging: Each; MSL: -; Logic Function Number: 2102; Operating Temperature Range: -40°C to +85; ComponentLink1URL: http://www.farnell.com/datasheets/1694195.pdf; ComponentLink1Description: http://www.farnell.com/datasheets/1694195.pdf; Supplier Part Number 1: 9282130

## Nets that join several sheets
BAT+: Vapeix_mini_power (D1.2), Vapeix_mini_Shield (12 pins)
GND: Vapeix_mini_nrf (22 pins), Vapeix_mini_power (5 pins), Vapeix_mini_Shield (24 pins), Vapeix_mini_connector (13 pins)
VBUS: Vapeix_mini_Shield (C25.1 U3.13), Vapeix_mini_connector (7 pins)
VDD_nRF: Vapeix_mini_nrf (8 pins), Vapeix_mini_power (SW1.3), Vapeix_mini_Shield (R31#2.2), Vapeix_mini_connector (P5.1)
VPP: Vapeix_mini_power (SW1.5), Vapeix_mini_Shield (6 pins)
ATM_EN: Vapeix_mini_nrf (U1.7), Vapeix_mini_Shield (R25.1 TP5.1)
Atom_PW: Vapeix_mini_nrf (U1.14), Vapeix_mini_Shield (SW2.1)
B_CH1: Vapeix_mini_nrf (U1.19), Vapeix_mini_Shield (Q1.2 SH2.1)
BAT_SENSE: Vapeix_mini_nrf (U1.43), Vapeix_mini_Shield (R9.2 R10.1 TP2#1.1)
BLE_SW: Vapeix_mini_nrf (U1.9), Vapeix_mini_Shield (SW3.1)
BuzzerEN: Vapeix_mini_nrf (U1.10), Vapeix_mini_Shield (R17.2)
Cartridge_EN: Vapeix_mini_nrf (U1.20), Vapeix_mini_Shield (R27.2)
G_CH1: Vapeix_mini_nrf (U1.18), Vapeix_mini_Shield (Q1.4 SH3.1)
~{M_PGOOD}: Vapeix_mini_nrf (U1.23), Vapeix_mini_Shield (R15.2 U3.7)
MCU_RX: Vapeix_mini_nrf (U1.15), Vapeix_mini_connector (U5.26)
MCU_TX: Vapeix_mini_nrf (U1.16), Vapeix_mini_connector (U5.25)
MotorEN: Vapeix_mini_nrf (U1.8), Vapeix_mini_Shield (R6.2)
nRST: Vapeix_mini_nrf (U1.24), Vapeix_mini_Shield (R31#2.1 SW4.1), Vapeix_mini_connector (P5.6 R4.2 U5.9)
R_CH1: Vapeix_mini_nrf (U1.17), Vapeix_mini_Shield (Q3.2 SH4.1)
SCL: Vapeix_mini_nrf (R31#1.1 U1.38), Vapeix_mini_connector (CON1.4)
SDA: Vapeix_mini_nrf (R30.1 U1.39), Vapeix_mini_Shield (R27.1), Vapeix_mini_connector (CON1.3)
SWDCLK: Vapeix_mini_nrf (U1.25), Vapeix_mini_connector (P5.4)
SWDIO: Vapeix_mini_nrf (U1.26), Vapeix_mini_connector (P5.2)